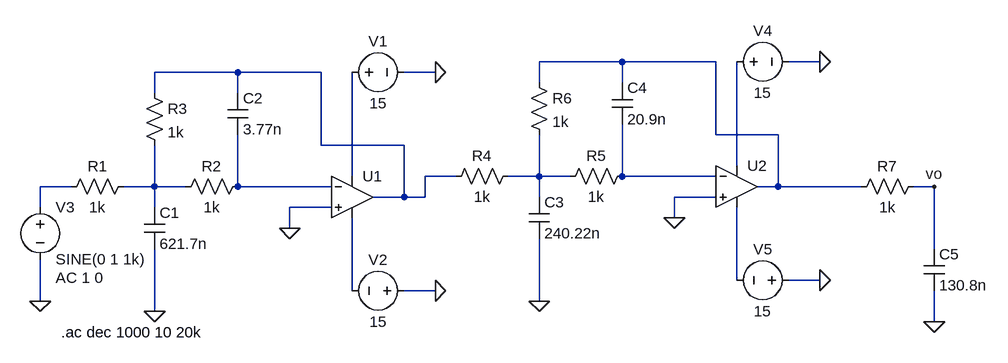
[diagram p0: schematic Ex4_MFB.asc]
Ex4_MFB.asc, the LTspice schematic file:
Version 4
SHEET 1 1228 680
WIRE 656 0 528 0
WIRE 800 0 656 0
WIRE 960 0 912 0
WIRE 64 16 -64 16
WIRE 192 16 64 16
WIRE 368 16 320 16
WIRE 528 32 528 0
WIRE 656 32 656 0
WIRE -64 48 -64 16
WIRE 64 48 64 16
WIRE 800 112 800 0
WIRE 896 112 800 112
WIRE 192 128 192 16
WIRE 320 128 192 128
WIRE 832 160 832 0
WIRE 240 176 240 16
WIRE 400 176 352 176
WIRE 528 176 528 112
WIRE 528 176 480 176
WIRE 576 176 528 176
WIRE 656 176 656 96
WIRE 800 176 656 176
WIRE -192 192 -240 192
WIRE -64 192 -64 128
WIRE -64 192 -112 192
WIRE -16 192 -64 192
WIRE 64 192 64 112
WIRE 208 192 64 192
WIRE 896 192 896 112
WIRE 896 192 864 192
WIRE 1024 192 896 192
WIRE 1136 192 1104 192
WIRE 320 208 320 128
WIRE 320 208 272 208
WIRE 352 208 352 176
WIRE 352 208 320 208
WIRE 528 208 528 176
WIRE 800 208 736 208
WIRE -240 224 -240 192
WIRE -64 224 -64 192
WIRE 208 224 144 224
WIRE 736 240 736 208
WIRE 144 256 144 224
WIRE 1136 288 1136 192
WIRE 832 336 832 224
WIRE 960 336 912 336
WIRE 240 352 240 240
WIRE 368 352 320 352
WIRE -240 368 -240 304
WIRE 528 368 528 272
WIRE -64 384 -64 288
WIRE 1136 400 1136 352
FLAG 144 256 0
FLAG 368 352 0
FLAG 368 16 0
FLAG -240 368 0
FLAG -64 384 0
FLAG 736 240 0
FLAG 960 336 0
FLAG 960 0 0
FLAG 528 368 0
FLAG 1136 400 0
FLAG 1136 192 vo
SYMBOL res -96 176 R90
WINDOW 0 0 56 VBottom 2
WINDOW 3 32 56 VTop 2
SYMATTR InstName R1
SYMATTR Value 1k
SYMBOL res -80 32 R0
SYMATTR InstName R3
SYMATTR Value 1k
SYMBOL res 80 176 R90
WINDOW 0 0 56 VBottom 2
WINDOW 3 32 56 VTop 2
SYMATTR InstName R2
SYMATTR Value 1k
SYMBOL cap 48 48 R0
SYMATTR InstName C2
SYMATTR Value 3.77n
SYMBOL OpAmps\\UniversalOpAmp 240 208 R0
SYMATTR InstName U1
SYMBOL voltage 224 16 R270
WINDOW 0 32 56 VTop 2
WINDOW 3 -32 56 VBottom 2
WINDOW 123 0 0 Left 0
WINDOW 39 0 0 Left 0
SYMATTR InstName V1
SYMATTR Value 15
SYMBOL voltage 336 352 R90
WINDOW 0 -32 56 VBottom 2
WINDOW 3 32 56 VTop 2
WINDOW 123 0 0 Left 0
WINDOW 39 0 0 Left 0
SYMATTR InstName V2
SYMATTR Value 15
SYMBOL voltage -240 208 R0
WINDOW 123 24 124 Left 2
WINDOW 39 0 0 Left 0
SYMATTR InstName V3
SYMATTR Value SINE(0 1 1k)
SYMATTR Value2 AC 1 0
SYMBOL cap -80 224 R0
SYMATTR InstName C1
SYMATTR Value 621.7n
SYMBOL res 512 16 R0
SYMATTR InstName R6
SYMATTR Value 1k
SYMBOL res 672 160 R90
WINDOW 0 0 56 VBottom 2
WINDOW 3 32 56 VTop 2
SYMATTR InstName R5
SYMATTR Value 1k
SYMBOL cap 640 32 R0
SYMATTR InstName C4
SYMATTR Value 20.9n
SYMBOL OpAmps\\UniversalOpAmp 832 192 R0
SYMATTR InstName U2
SYMBOL voltage 816 0 R270
WINDOW 0 32 56 VTop 2
WINDOW 3 -32 56 VBottom 2
WINDOW 123 0 0 Left 0
WINDOW 39 0 0 Left 0
SYMATTR InstName V4
SYMATTR Value 15
SYMBOL voltage 928 336 R90
WINDOW 0 -32 56 VBottom 2
WINDOW 3 32 56 VTop 2
WINDOW 123 0 0 Left 0
WINDOW 39 0 0 Left 0
SYMATTR InstName V5
SYMATTR Value 15
SYMBOL cap 512 208 R0
SYMATTR InstName C3
SYMATTR Value 240.22n
SYMBOL res 496 160 R90
WINDOW 0 0 56 VBottom 2
WINDOW 3 32 56 VTop 2
SYMATTR InstName R4
SYMATTR Value 1k
SYMBOL res 1120 176 R90
WINDOW 0 0 56 VBottom 2
WINDOW 3 32 56 VTop 2
SYMATTR InstName R7
SYMATTR Value 1k
SYMBOL cap 1120 288 R0
SYMATTR InstName C5
SYMATTR Value 130.8n
TEXT -208 416 Left 2 !.ac dec 1000 10 20k

The netlist it stands for:
* Ex4_MFB.asc
R1 N008 N007 1k
R3 N002 N008 1k
R2 N009 N008 1k
C2 N002 N009 3.77n
XU1 0 N009 N004 N011 N002 level1 Avol=1Meg GBW=10Meg Vos=0 En=0 Enk=0 In=0 Ink=0 Rin=500Meg  ; pins In+ In- V+ V- OUT
V1 N004 0 15
V2 0 N011 15
V3 N007 0 SINE(0 1 1k) AC 1 0
C1 N008 0 621.7n
R6 N001 N005 1k
R5 N006 N005 1k
C4 N001 N006 20.9n
XU2 0 N006 N003 N010 N001 level1 Avol=1Meg GBW=10Meg Vos=0 En=0 Enk=0 In=0 Ink=0 Rin=500Meg  ; pins In+ In- V+ V- OUT
V4 N003 0 15
V5 0 N010 15
C3 N005 0 240.22n
R4 N005 N002 1k
R7 vo N001 1k
C5 vo 0 130.8n
.ac dec 1000 10 20k
.lib UniversalOpAmp1.lib
.backanno
.end